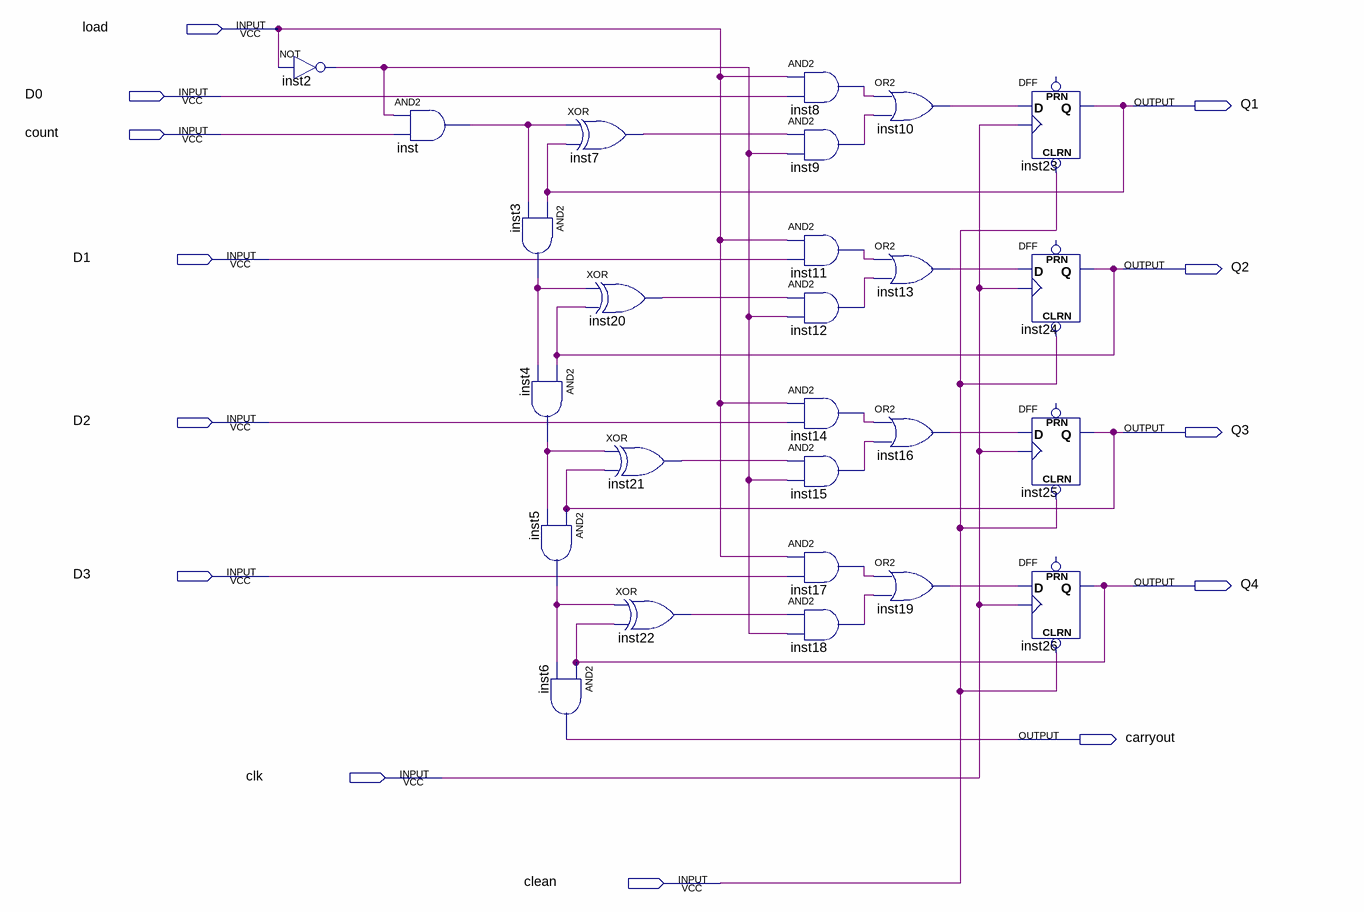
[diagram p0: schematic sheet]
// Quartus schematic counter.bdf as structural Verilog: 26 symbols, 13 pins
module counter (
  input  load,
  input  D0,
  input  count,
  input  D1,
  input  D2,
  input  D3,
  input  clk,
  input  clean,
  output Q1,
  output Q2,
  output Q3,
  output Q4,
  output carryout
);

  wire inst2_out, inst3_out, inst4_out, inst5_out, inst7_out, inst8_out, inst9_out, inst10_out, inst11_out,
       inst12_out, inst13_out, inst14_out, inst15_out, inst16_out, inst17_out, inst18_out, inst19_out,
       inst20_out, inst21_out, inst22_out, inst_out;

  not inst2 (inst2_out, load);
  and inst (inst_out, inst2_out, count);
  and inst3 (inst3_out, Q1, inst_out);
  and inst4 (inst4_out, Q2, inst3_out);
  and inst5 (inst5_out, Q3, inst4_out);
  and inst6 (carryout, Q4, inst5_out);
  xor inst7 (inst7_out, inst_out, Q1);
  xor inst20 (inst20_out, inst3_out, Q2);
  xor inst21 (inst21_out, inst4_out, Q3);
  xor inst22 (inst22_out, inst5_out, Q4);
  and inst8 (inst8_out, load, D0);
  and inst9 (inst9_out, inst7_out, inst2_out);
  and inst11 (inst11_out, load, D1);
  and inst12 (inst12_out, inst20_out, inst2_out);
  and inst14 (inst14_out, load, D2);
  and inst15 (inst15_out, inst21_out, inst2_out);
  and inst17 (inst17_out, load, D3);
  and inst18 (inst18_out, inst22_out, inst2_out);
  or inst10 (inst10_out, inst8_out, inst9_out);
  or inst13 (inst13_out, inst11_out, inst12_out);
  or inst16 (inst16_out, inst14_out, inst15_out);
  or inst19 (inst19_out, inst17_out, inst18_out);
  DFF inst23 (.CLRN(clean), .CLK(clk), .D(inst10_out), .Q(Q1));  // open: PRN
  DFF inst24 (.CLRN(clean), .CLK(clk), .D(inst13_out), .Q(Q2));  // open: PRN
  DFF inst25 (.CLRN(clean), .CLK(clk), .D(inst16_out), .Q(Q3));  // open: PRN
  DFF inst26 (.CLRN(clean), .CLK(clk), .D(inst19_out), .Q(Q4));  // open: PRN
endmodule
